# EAGLE design SparkFun_Energy_Harvester_Breakout-LTC3588 (EAGLE 7.2.0)
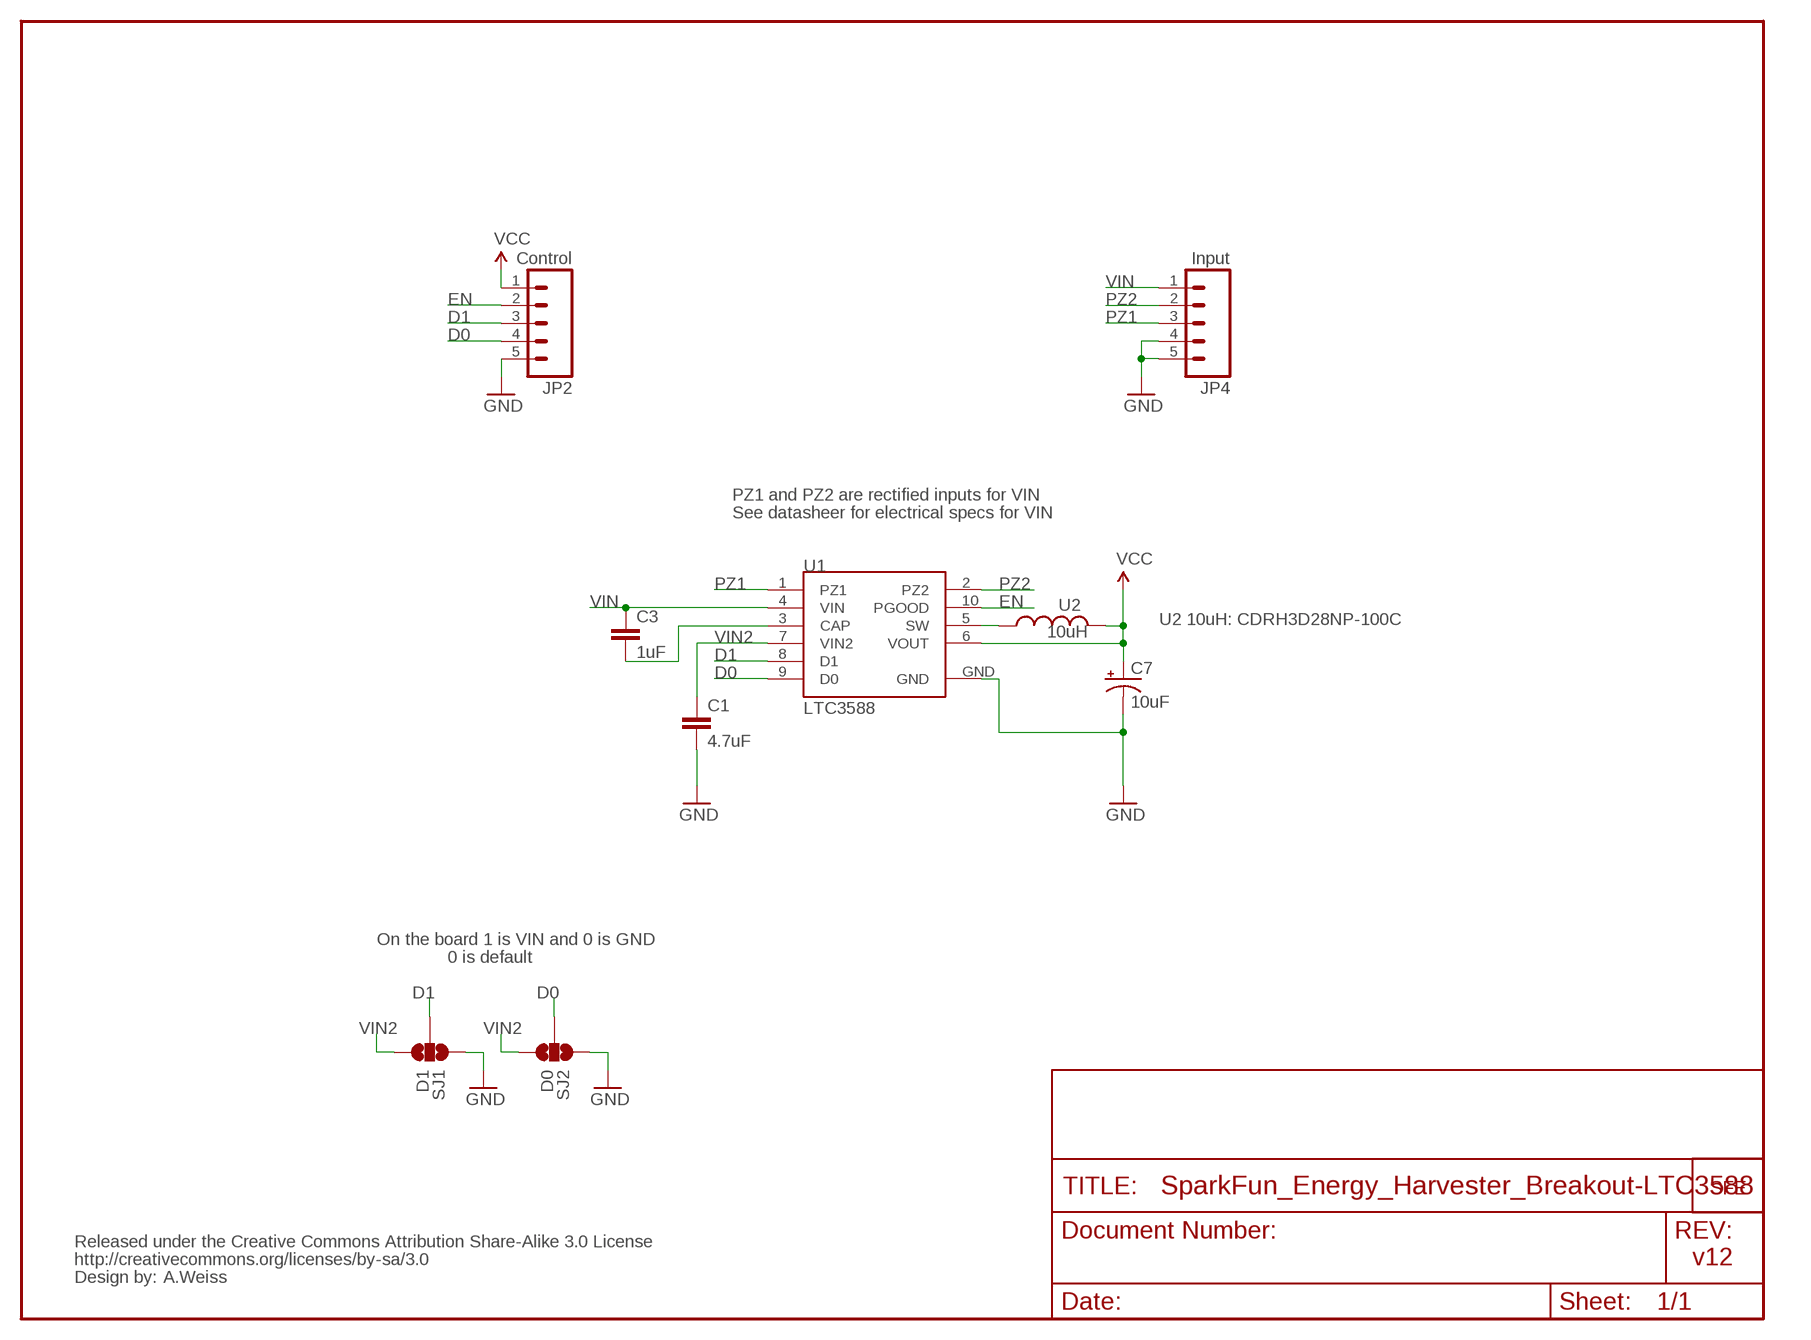
[diagram p0: schematic, sheet 1]

## Parts
C1  4.7uF  CAP0402-CAP  [0402-CAP]
C3  1uF  CAP0402-CAP  [0402-CAP]
C7  10uF  CAP_POL1206  [EIA3216]
JP1  LOGO-SFESK  [SFE-LOGO-FLAME]
JP2  Control  M05PTH  [1X05]
JP4  Input  M05PTH  [1X05]
SJ1  D1  SOLDERJUMPER_2WAYPASTE2&3  [SJ_3_PASTE2&3]
SJ2  D0  SOLDERJUMPER_2WAYPASTE1&2  [SJ_3_PASTE1&2]
U1  LTC3588  LTC3588_  [MSOP-10-GNDPAD]
U2  10uH  INDUCTOR-  [CDRH3D28]
U$1  CREATIVE_COMMONS  [CREATIVE_COMMONS]

## Nets
D0: JP2.4 SJ2.2 U1.9(D0)
D1: JP2.3 SJ1.2 U1.8(D1)
EN: JP2.2 U1.10(PGOOD)
GND: C1.2 C7.C(-) JP2.5 JP4.4 JP4.5 SJ1.1 SJ2.1 U1.GND
N$2: C3.2 U1.3(CAP)
N$6: U1.5(SW) U2.1
PZ1: JP4.3 U1.1(PZ1)
PZ2: JP4.2 U1.2(PZ2)
VCC: C7.A(+) JP2.1 U1.6(VOUT) U2.2
VIN: C3.1 JP4.1 U1.4(VIN)
VIN2: C1.1 SJ1.3 SJ2.3 U1.7(VIN2)

## Notes on the sheet
- PZ1 and PZ2 are rectified inputs for VIN
- See datasheer for electrical specs for VIN
- U2 10uH: CDRH3D28NP-100C
- On the board 1 is VIN and 0 is GND
- 0 is default
- v12
- A.Weiss

## Library data of the parts
C1 C3 = SparkFun:CAP: Capacitor Standard 0603 ceramic capacitor, and 0.1" leaded capacitor.
C7 = SparkFun:CAP_POL: Capacitor Polarized These are standard SMD and PTH capacitors. Normally 10uF, 47uF, and 100uF in electrolytic and tantalum varieties. Always verify the external diameter of the through hole cap, it varies with capacity, voltage, and manufacturer. The EIA devices should be standard.
JP1 = SparkFun:LOGO-SFE: Spark Fun Electronics PCB Logo This is the standard Spark Fun Electronics PCB logo.
JP2 JP4 = SparkFun:M05: Header 5 Standard 5-pin 0.1" header. Use with straight break away headers (SKU : PRT-00116), right angle break away headers (PRT-00553), swiss pins (PRT-00743), machine pins (PRT-00117), and female headers (PRT-00115). Molex polarized connector foot print use with SKU : PRT-08230 with associated crimp pins and housings.
SJ1 SJ2 = SparkFun:SOLDERJUMPER_2WAY: Solder Jumper 2 way solder jumper
U1 = SparkFun:LTC3588: LTC3588 Energy Harvesting Power Supply
U2 = SparkFun:INDUCTOR: Inductors Basic Inductor/Choke - 0603 and 1206. Footprints are not proven and vary greatly between part numbers.
U$1 = SparkFun:CREATIVE_COMMONS

## Board
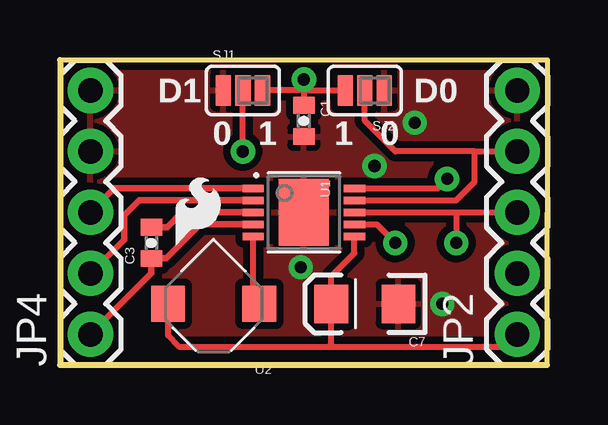
[diagram p1: board, top side]
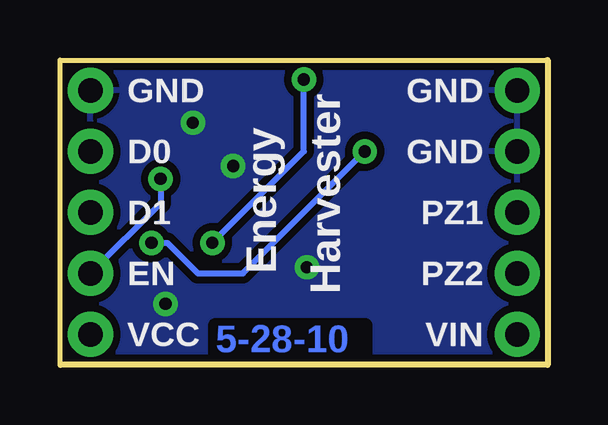
[diagram p2: board, bottom side, seen from below]

Size 20.32 x 12.7 mm. Coordinates in mm from the lower left corner, seen from the top.
Outline: 0,0 20.3,0 20.32,12.7 0,12.7 0,0
Copper layers (1*16): Top 0.035mm / dielectric 1.5mm / Bottom 0.035mm
Design rules "SparkFun": minimum track width 8mil, minimum drill 20mil, track to track 8mil, track to pad 8mil, pad to pad 8mil, via to via 8mil, smd to smd 8mil, copper to edge 8mil, drill to drill 8mil, minimum pad ring 12mil, minimum via ring 10mil, stop-mask expansion 4mil, vias tented up to drill 20mil, thermal gap 10mil

### Footprints (pad centres in the part's own frame; a part is rotated, then mirrored left to right if it is on the bottom)
0402-CAP = smd 0.7 x 0.9: 1 -0.65,0; 2 0.65,0
EIA3216 = smd 1.4 x 1.6: A 1.4,0; C -1.4,0
1X05 = drill 1.016 pad 1.88: 1 0,0; 2 2.54,0; 3 5.08,0; 4 7.62,0; 5 10.16,0
SJ_3_PASTE2&3 = smd 0.635 x 1.27: 1 -0.813,0; 2 0,0; 3 0.813,0
SJ_3_PASTE1&2 = smd 0.635 x 1.27: 1 -0.813,0; 2 0,0; 3 0.813,0
MSOP-10-GNDPAD = smd 0.305 x 0.889: 1 -1,-2.11; 2 -0.5,-2.11; 3 0,-2.11; 4 0.5,-2.11; 5 1,-2.11; 6 1,2.11; 7 0.5,2.11; 8 0,2.11; 9 -0.5,2.11; 10 -1,2.11 | smd 2.794 x 2.083: GND 0,0
CDRH3D28 = smd 1.4 x 1.5: 1 -1.95,-0.007; 2 1.849,-0.007

### Placement (x,y rotation side)
C1  10.16,10.16 270 top
C3  3.81,5.08 90 top
C7  12.7,2.54 180 top
JP1  4.83,4.98 0 top
JP2  19.05,1.27 90 top
JP4  1.27,1.27 90 top
SJ1  7.62,11.43 0 top
SJ2  12.7,11.43 180 top
U1  10.16,6.35 270 top
U2  6.35,2.54 180 top
U$1  19.05,-8.89 0 top  (outside the outline)

### Tracks (layer width: path | path; a pad name or v marks a point on that pad's centre or on a via)
D0
  Top 0.254: SJ2.2 12.7,10.16 13.97,8.89 17.27,8.89 | 17.27,8.89 JP2.4 | U1.9 16.5,6.85 17.27,7.62 17.27,8.89
D1  (via drill 0.51)
  Top 0.254: 16.51,6.35 JP2.3 | v7.62,8.89 SJ1.2 | U1.8 16.51,6.35 | 16.51,6.35 v16.51,5.08
  Bottom 0.254: v7.62,8.89 12.7,3.81 14.58,3.81 15.85,5.08 v16.51,5.08
EN  (via drill 0.51)
  Top 0.254: U1.10 15.73,7.35 v16.13,7.75
  Bottom 0.254: v16.13,7.75 16.13,6.73 JP2.2
GND  (via drill 0.51)
  other vias: 10.03,4.06 15.93,2.54 14.78,10.08 13.11,8.28
  pour Bottom (isolate 0.305): 0,12.7 0,0 20.32,0 20.32,12.7
  pour Top (isolate 0.305): 0,12.7 0,0 20.32,0 20.32,12.7
N$2
  Top 0.279: U1.3 5.08,6.35 4.46,5.73 C3.2
N$6
  Top 0.254: U1.5 8.05,2.8 U2.1
PZ1
  Top 0.279: U1.1 2.27,7.35 JP4.3
PZ2
  Top 0.279: JP4.2 2.67,5.21 2.67,6.22 3.29,6.85 U1.2
VCC
  Top 0.254: U2.2 4.5,1.21 4.95,0.76 11.3,0.76 | C7.A | U1.6 12.27,4.65 11.3,3.68 C7.A | 11.3,0.76 18.54,0.76 JP2.1 | C7.A 11.3,0.77 11.3,0.76
VIN
  Top 0.279: U1.4 5.85,5.85 4.43,4.43 C3.1 3.81,3.81 JP4.1
VIN2  (via drill 0.51)
  Top 0.254: U1.7 13.2,5.85 v13.97,5.08 | v10.16,11.89 10.16,11.43 | 10.16,11.43 C1.1 | 10.16,11.43 SJ1.3 | 10.16,11.43 SJ2.3
  Bottom 0.254: v10.16,11.89 10.16,8.89 v13.97,5.08

### Text on the board
Bottom: 5-28-10
tPlace: D1 | D0 | 0 | 1 | 1 | 0
bPlace: GND | Harvester | GND | Energy | GND | D0 | PZ1 | D1 | PZ2 | EN | VIN | VCC